# EAGLE design Brainzy (EAGLE 9.0.0)
CNAME: Mr. Robotics; CREVISION: 3.2.1; DESIGNER: O. LEVEQUE

## Sheet 1 of 2
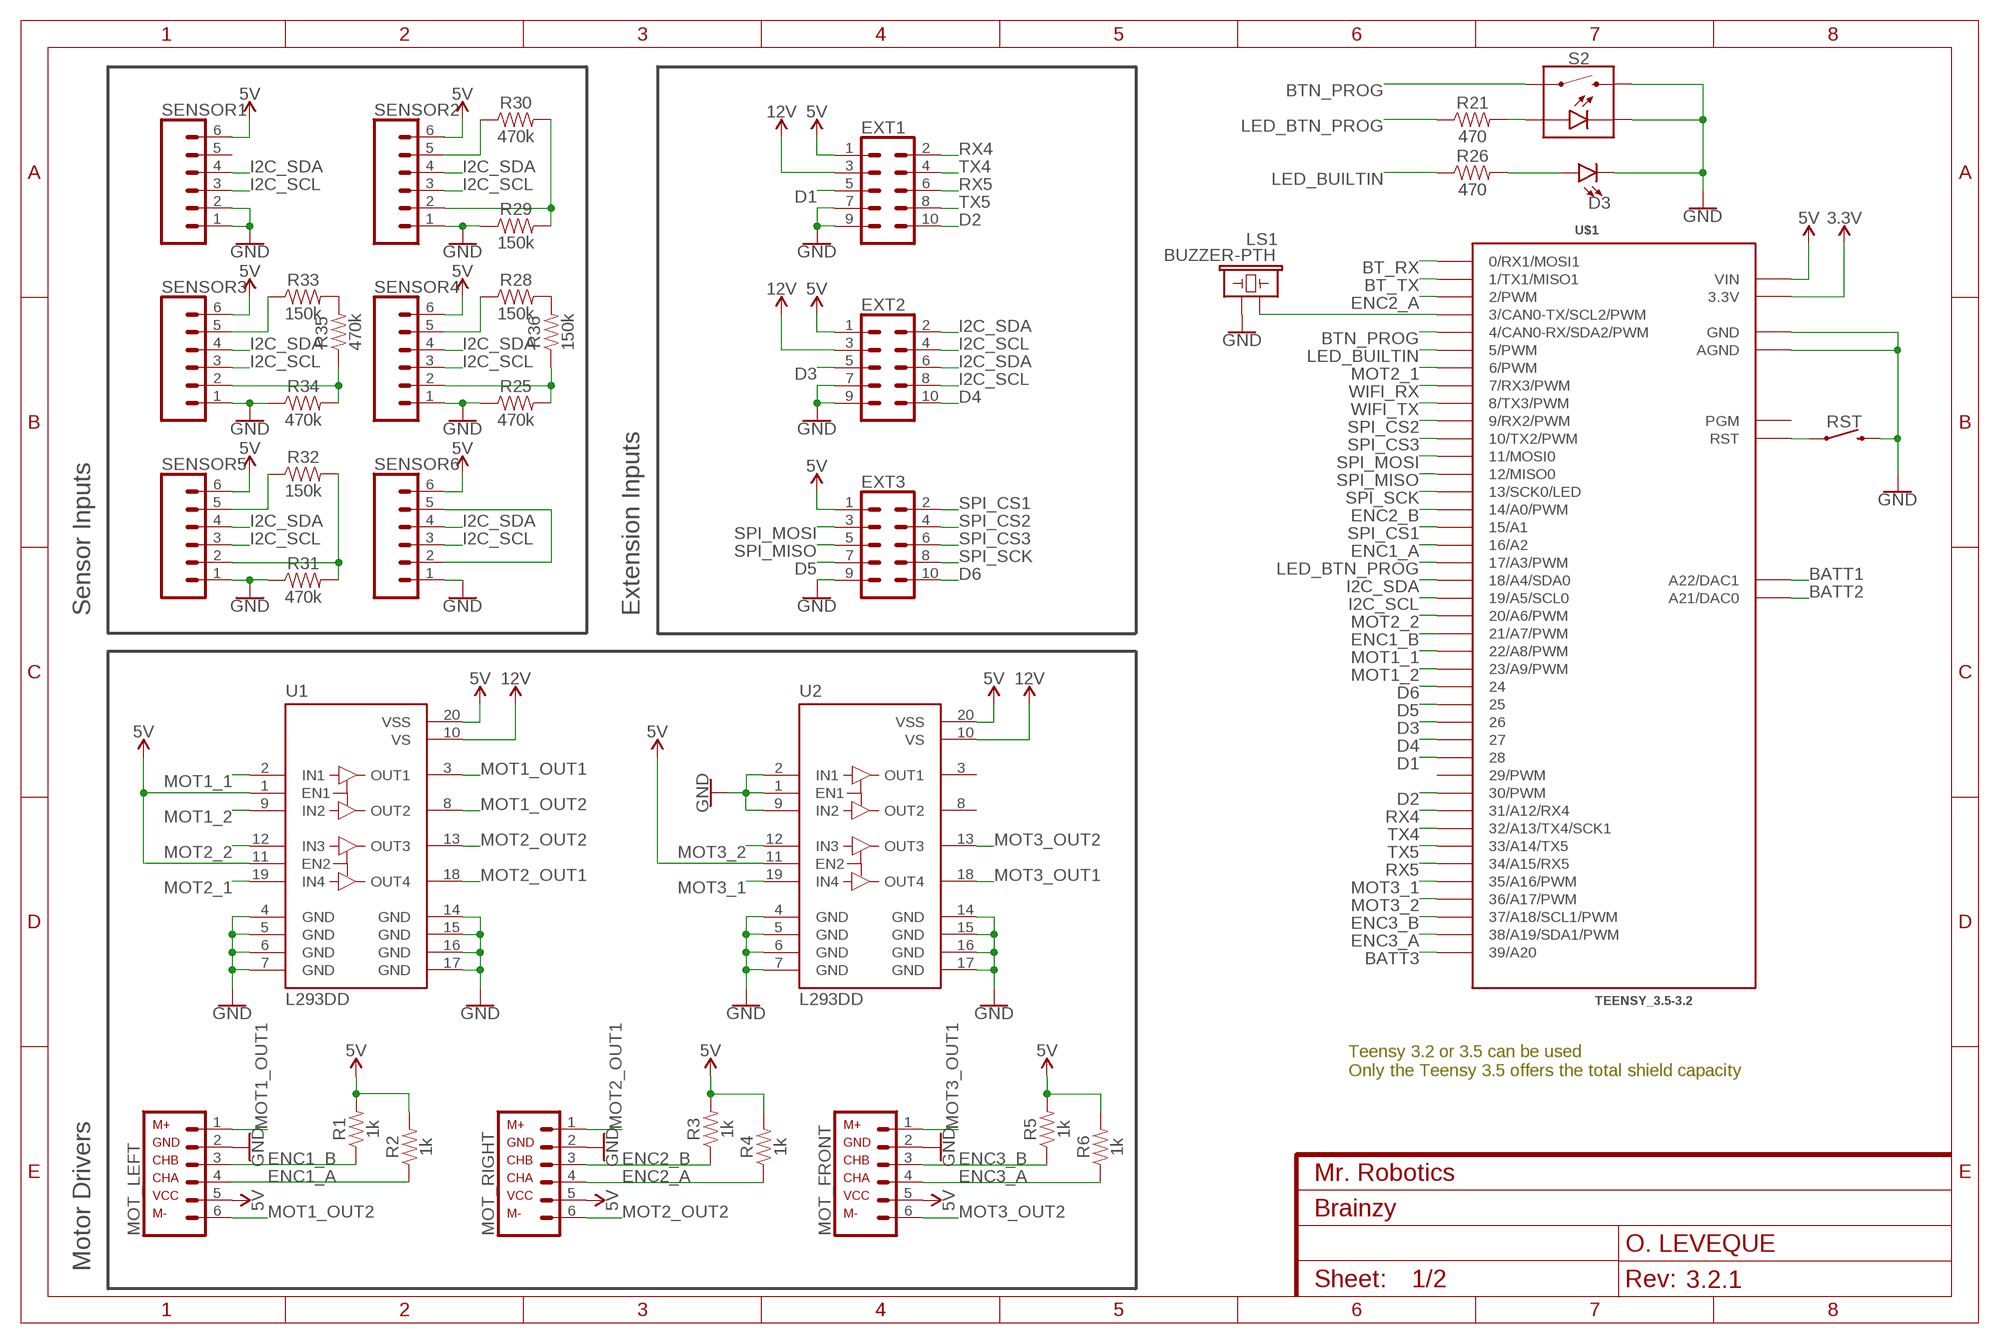
[diagram p0: schematic, sheet 1]

### Parts
D3  LED-FKIT-1206  [FKIT-LED-1206]
EXT1  CONN_05X2SHD_LOCK  [2X5-SHROUDED_LOCK]
EXT2  CONN_05X2SHD_LOCK  [2X5-SHROUDED_LOCK]
EXT3  CONN_05X2SHD_LOCK  [2X5-SHROUDED_LOCK]
LS1  BUZZER-PTH  [BUZZER-12MM]
MOT_FRONT  DC-MOTOR-CONNECTOR  [JST-PH6]
MOT_LEFT  DC-MOTOR-CONNECTOR  [JST-PH6]
MOT_RIGHT  DC-MOTOR-CONNECTOR  [JST-PH6]
R1  1k  10OHM-1206-1/4W-1%  [1206]
R2  1k  10OHM-1206-1/4W-1%  [1206]
R3  1k  10OHM-1206-1/4W-1%  [1206]
R4  1k  10OHM-1206-1/4W-1%  [1206]
R5  1k  10OHM-1206-1/4W-1%  [1206]
R6  1k  10OHM-1206-1/4W-1%  [1206]
R21  470  10OHM-1206-1/4W-1%  [1206]
R25  470k  10OHM-1206-1/4W-1%  [1206]
R26  470  10OHM-1206-1/4W-1%  [1206]
R28  150k  10OHM-1206-1/4W-1%  [1206]
R29  150k  10OHM-1206-1/4W-1%  [1206]
R30  470k  10OHM-1206-1/4W-1%  [1206]
R31  470k  10OHM-1206-1/4W-1%  [1206]
R32  150k  10OHM-1206-1/4W-1%  [1206]
R33  150k  10OHM-1206-1/4W-1%  [1206]
R34  470k  10OHM-1206-1/4W-1%  [1206]
R35  470k  10OHM-1206-1/4W-1%  [1206]
R36  150k  10OHM-1206-1/4W-1%  [1206]
RST  MOMENTARY-SWITCH-SPST-PTH-6.0MM  [TACTILE_SWITCH_PTH_6.0MM]
S2  MOMENTARY-SWITCH-SPST-LED-PTH-12MM  [TACTILE_SWITCH_LED_PTH_12MM]
SENSOR1  JST-ZH6  [JST-ZH6]
SENSOR2  JST-ZH6  [JST-ZH6]
SENSOR3  JST-ZH6  [JST-ZH6]
SENSOR4  JST-ZH6  [JST-ZH6]
SENSOR5  JST-ZH6  [JST-ZH6]
SENSOR6  JST-ZH6  [JST-ZH6]
U1  L293DD  [SOIC127P1033X265-20N]
U2  L293DD  [SOIC127P1033X265-20N]
U$1  TEENSY_3.5-3.2  [TEENSY_3.5-3.2]

### Nets
3.3V: U$1.3.3V U$1.3.3V1(3.3V) U$1.3.3V2(3.3V) U$1.3.3V3(3.3V) ; also sheet 2
5V: EXT1.1 EXT2.1 EXT3.1 MOT_FRONT.5(5-CHA) MOT_LEFT.5(5-CHA) MOT_RIGHT.5(5-CHA) R1.2 R2.2 R3.2 R4.2 R5.2 R6.2 SENSOR1.6 SENSOR2.6 SENSOR3.6 SENSOR4.6 SENSOR5.6 SENSOR6.6 U1.1(EN1) U1.11(EN2) U1.20(VSS) U2.11(EN2) U2.20(VSS) U$1.VIN ; also sheet 2
12V: EXT1.3 EXT2.3 U1.10(VS) U2.10(VS) ; also sheet 2
BATT1: U$1.A22(A22/DAC1) ; also sheet 2
BATT2: U$1.A21(A21/DAC0) ; also sheet 2
BATT3: U$1.39/A20 ; also sheet 2
BT_RX: U$1.0(0/RX1/MOSI1) ; also sheet 2
BT_TX: U$1.1(1/TX1/MISO1) ; also sheet 2
BTN_PROG: S2.4 U$1.4(4/CAN0-RX/SDA2/PWM)
BUZZER: LS1.+ U$1.3(3/CAN0-TX/SCL2/PWM)
D1: EXT1.5 U$1.28
D2: EXT1.10 U$1.30(30/PWM)
D3: EXT2.5 U$1.26
D4: EXT2.10 U$1.27
D5: EXT3.7 U$1.25
D6: EXT3.10 U$1.24
ENC1_A: MOT_LEFT.4(4-GND) R2.1 U$1.16/A2
ENC1_B: MOT_LEFT.3(3-VCC) R1.1 U$1.21/A7(21/A7/PWM)
ENC2_A: MOT_RIGHT.4(4-GND) R4.1 U$1.2(2/PWM)
ENC2_B: MOT_RIGHT.3(3-VCC) R3.1 U$1.14/A0(14/A0/PWM)
ENC3_A: MOT_FRONT.4(4-GND) R6.1 U$1.38/A19(38/A19/SDA1/PWM)
ENC3_B: MOT_FRONT.3(3-VCC) R5.1 U$1.37/A18(37/A18/SCL1/PWM)
GND: D3.C EXT1.7 EXT1.9 EXT2.7 EXT2.9 EXT3.9 LS1.- MOT_FRONT.2(2-M+) MOT_LEFT.2(2-M+) MOT_RIGHT.2(2-M+) R25.1 R29.1 R31.1 R34.1 RST.3 S2.2 S2.C SENSOR1.1 SENSOR1.2 SENSOR2.1 SENSOR3.1 SENSOR4.1 SENSOR5.1 SENSOR6.1 U1.4(GND) U1.5(GND) U1.6(GND) U1.7(GND) U1.14(GND) U1.15(GND) U1.16(GND) U1.17(GND) U2.1(EN1) U2.2(IN1) U2.4(GND) U2.5(GND) U2.6(GND) U2.7(GND) U2.9(IN2) U2.14(GND) U2.15(GND) U2.16(GND) U2.17(GND) U$1.AGND U$1.GND U$1.GND1(GND) U$1.GND2(GND) U$1.GND3(GND) ; also sheet 2
I2C_SCL: EXT2.4 EXT2.8 SENSOR1.3 SENSOR2.3 SENSOR3.3 SENSOR4.3 SENSOR5.3 SENSOR6.3 U$1.19/A5(19/A5/SCL0)
I2C_SDA: EXT2.2 EXT2.6 SENSOR1.4 SENSOR2.4 SENSOR3.4 SENSOR4.4 SENSOR5.4 SENSOR6.4 U$1.18/A4(18/A4/SDA0)
LED_BTN_PROG: R21.1 U$1.17/A3(17/A3/PWM)
LED_BUILTIN: R26.1 U$1.5(5/PWM)
MOT1_1: U1.2(IN1) U$1.22/A8(22/A8/PWM)
MOT1_2: U1.9(IN2) U$1.23/A9(23/A9/PWM)
MOT1_OUT1: MOT_LEFT.1(1-M-) U1.3(OUT1)
MOT1_OUT2: MOT_LEFT.6(6-CHB) U1.8(OUT2)
MOT2_1: U1.19(IN4) U$1.6(6/PWM)
MOT2_2: U1.12(IN3) U$1.20/A6(20/A6/PWM)
MOT2_OUT1: MOT_RIGHT.1(1-M-) U1.18(OUT4)
MOT2_OUT2: MOT_RIGHT.6(6-CHB) U1.13(OUT3)
MOT3_1: U2.19(IN4) U$1.35/A16(35/A16/PWM)
MOT3_2: U2.12(IN3) U$1.36/A17(36/A17/PWM)
MOT3_OUT1: MOT_FRONT.1(1-M-) U2.18(OUT4)
MOT3_OUT2: MOT_FRONT.6(6-CHB) U2.13(OUT3)
N$12: D3.A R26.2
N$16: R21.2 S2.A
N$17: SENSOR6.2 SENSOR6.5
N$20: R25.2 R36.1 SENSOR4.2
N$21: R28.1 SENSOR4.5
N$22: R31.2 R32.2 SENSOR5.2
N$23: R32.1 SENSOR5.5
N$24: R29.2 R30.2 SENSOR2.2
N$25: R30.1 SENSOR2.5
N$26: R33.2 R35.2
N$27: R34.2 R35.1 SENSOR3.2
N$28: R33.1 SENSOR3.5
N$29: R28.2 R36.2
RST: RST.1 U$1.RST_3.5(RST)
RX4: EXT1.2 U$1.31/A12(31/A12/RX4)
RX5: EXT1.6 U$1.34/A15(34/A15/RX5)
SPI_CS1: EXT3.2 U$1.15/A1
SPI_CS2: EXT3.4 U$1.9(9/RX2/PWM)
SPI_CS3: EXT3.6 U$1.10(10/TX2/PWM)
SPI_MISO: EXT3.5 U$1.12(12/MISO0)
SPI_MOSI: EXT3.3 U$1.11(11/MOSI0)
SPI_SCK: EXT3.8 U$1.13(13/SCK0/LED)
TX4: EXT1.4 U$1.32/A13(32/A13/TX4/SCK1)
TX5: EXT1.8 U$1.33/A14(33/A14/TX5)
WIFI_RX: U$1.7(7/RX3/PWM) ; also sheet 2
WIFI_TX: U$1.8(8/TX3/PWM) ; also sheet 2
Unconnected: SENSOR1.5 U2.3(OUT1) U2.8(OUT2) U$1.29(29/PWM) U$1.PGM_3.2(PGM) U$1.PGM_3.5(PGM)

### Notes on the sheet
- Sensor Inputs | Extension Inputs
- Teensy 3.2 or 3.5 can be used
  Only the Teensy 3.5 offers the total shield capacity
- Motor Drivers

## Sheet 2 of 2
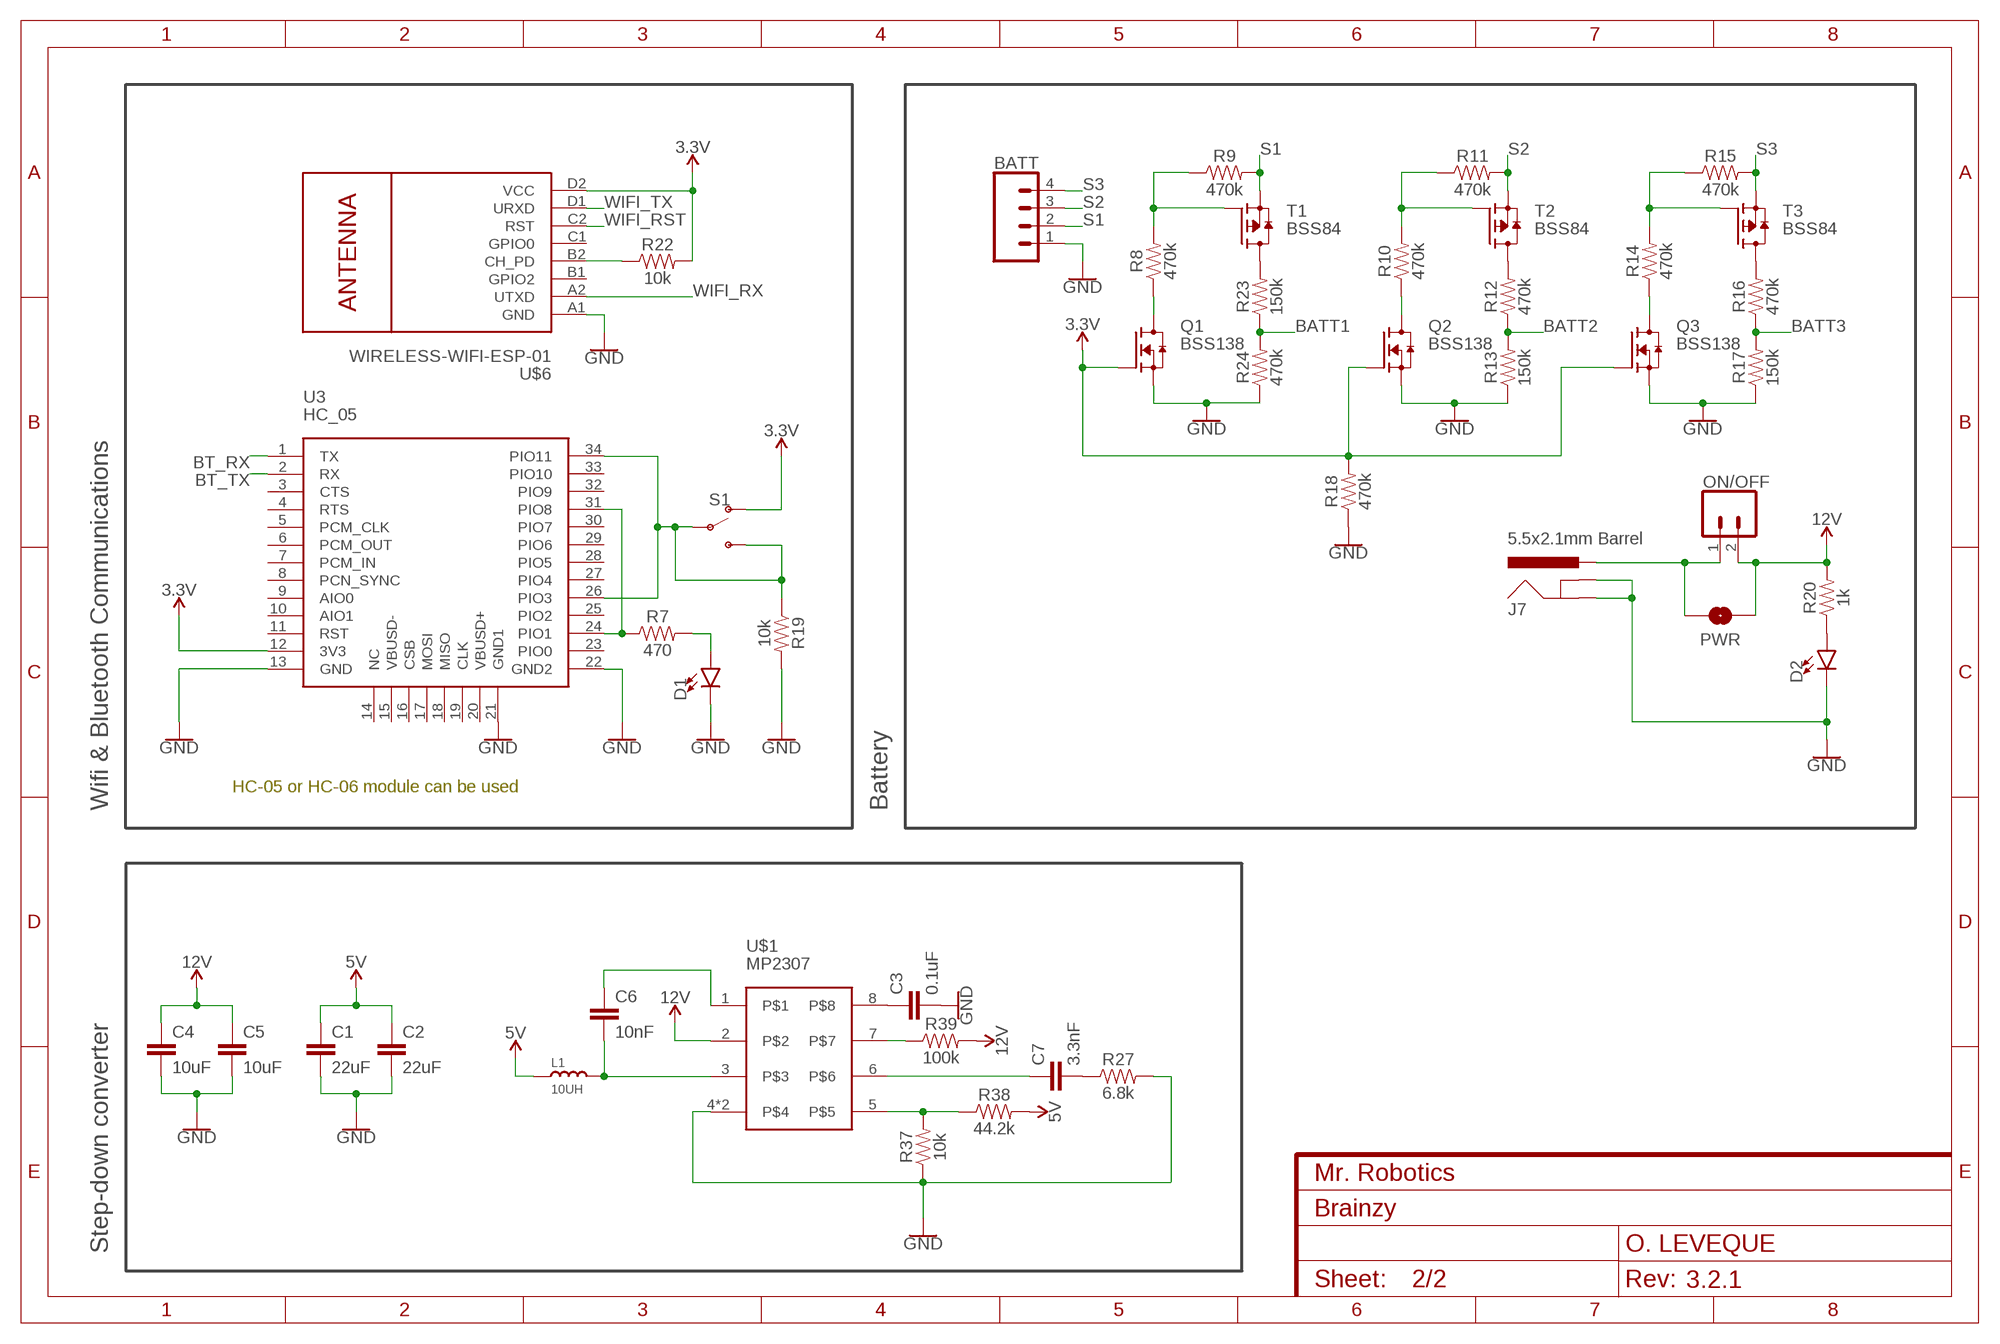
[diagram p1: schematic, sheet 2]

### Parts
BATT  CONN_04LOCK_LONGPADS  [1X04_LOCK_LONGPADS]
BK  MP2307  [SOIC127P600X170-9N]
C1  22uF  22UF-0805-6.3V-20%  [0805]
C2  22uF  22UF-0805-6.3V-20%  [0805]
C3  0.1uF  0.1UF-0603-25V-5%  [0603]
C4  10uF  10UF-1210-50V-20%  [1210]
C5  10uF  10UF-1210-50V-20%  [1210]
C6  10nF  10NF-0603-50V-10%  [0603]
C7  3.3nF  3.3NF-0603-100V-10%  [0603]
D1  LED-FKIT-1206  [FKIT-LED-1206]
D2  LED-FKIT-1206  [FKIT-LED-1206]
J7  5.5x2.1mm Barrel  POWER_JACKSMD  [POWER_JACK_SMD]
L1  10UH  SMD-INDUCTOR-10UH-20%(2P-6X6MM)'0630'  [SMD-2P-L6.0XW6.0XH3.0MM]
ON/OFF  JST-XH-02-PIN-LONG-PAD  [JST-XH-02-PACKAGE-LONG-PAD]
PWR  JUMPER-SMT_2_NO_SILK  [SMT-JUMPER_2_NO_SILK]
Q1  BSS138  [SOT23]
Q2  BSS138  [SOT23]
Q3  BSS138  [SOT23]
R7  470  10OHM-1206-1/4W-1%  [1206]
R8  470k  10OHM-1206-1/4W-1%  [1206]
R9  470k  10OHM-1206-1/4W-1%  [1206]
R10  470k  10OHM-1206-1/4W-1%  [1206]
R11  470k  10OHM-1206-1/4W-1%  [1206]
R12  470k  10OHM-1206-1/4W-1%  [1206]
R13  150k  10OHM-1206-1/4W-1%  [1206]
R14  470k  10OHM-1206-1/4W-1%  [1206]
R15  470k  10OHM-1206-1/4W-1%  [1206]
R16  470k  10OHM-1206-1/4W-1%  [1206]
R17  150k  10OHM-1206-1/4W-1%  [1206]
R18  470k  10OHM-1206-1/4W-1%  [1206]
R19  10k  10OHM-1206-1/4W-1%  [1206]
R20  1k  10OHM-1206-1/4W-1%  [1206]
R22  10k  10OHM-1206-1/4W-1%  [1206]
R23  150k  10OHM-1206-1/4W-1%  [1206]
R24  470k  10OHM-1206-1/4W-1%  [1206]
R27  6.8k  6.8KOHM-0603-1/10W-1%  [0603]
R37  10k  10KOHM-0603-1/10W-1%  [0603]
R38  44.2k  43KOHM-0603-1/10W-1%  [0603]
R39  100k  100KOHM-0603-1/10W-1%  [0603]
S1  SWITCH-SPDT-SMD-RIGHT-ANGLE  [SWITCH_SPST_SMD_A]
T1  BSS84  [SOT23]
T2  BSS84  [SOT23]
T3  BSS84  [SOT23]
U3  HC_05  [BLUETOOTH_SMD]
U$6  WIRELESS-WIFI-ESP-01  [WIRELESS-WIFI-ESP-01]

### Nets
3.3V: Q1.1(G) Q2.1(G) Q3.1(G) R18.2 R22.2 S1.1(O) U3.12(3V3) U$6.D2(VCC) ; also sheet 1
5V: C1.1 C2.1 L1.1 R38.2 ; also sheet 1
12V: BK.2 C4.1 C5.1 ON/OFF.2 PWR.2 R20.2 R39.2 ; also sheet 1
BATT1: R23.1 R24.2 ; also sheet 1
BATT2: R12.1 R13.2 ; also sheet 1
BATT3: R16.1 R17.2 ; also sheet 1
BT_RX: U3.1(TX) ; also sheet 1
BT_TX: U3.2(RX) ; also sheet 1
GND: BATT.1 BK.4 BK.9 C1.2 C2.2 C3.2 C4.2 C5.2 D1.C D2.C J7.GND(GNDBREAK) J7.P$4(GND) Q1.2(S) Q2.2(S) Q3.2(S) R13.1 R17.1 R18.1 R19.2 R24.1 R27.2 R37.1 U3.13(GND) U3.21(GND1) U3.22(GND2) U$6.A1(GND) ; also sheet 1
N$1: R12.2 T2.3(D)
N$2: D2.A R20.1
N$3: R22.1 U$6.B2(CH_PD)
N$4: R8.2 R9.1 T1.1(G)
N$5: Q1.3(D) R8.1
N$6: R16.2 T3.3(D)
N$7: R10.2 R11.1 T2.1(G)
N$8: BK.7 R39.1
N$9: R7.1 U3.24(PIO1) U3.31(PIO8)
N$10: D1.A R7.2
N$11: Q2.3(D) R10.1
N$13: R14.2 R15.1 T3.1(G)
N$14: Q3.3(D) R14.1
N$15: J7.VIN0(PWR) ON/OFF.1 PWR.1
N$18: R19.1 S1.2(P) S1.3(S) U3.26(PIO3) U3.34(PIO11)
N$19: R23.2 T1.3(D)
N$30: BK.5 R37.2 R38.1
N$32: BK.8 C3.1
N$33: BK.6 C7.1
N$34: BK.3 C6.2 L1.2
N$35: C7.2 R27.1
N$36: BK.1 C6.1
S1: BATT.2 R9.2 T1.2(S)
S2: BATT.3 R11.2 T2.2(S)
S3: BATT.4 R15.2 T3.2(S)
WIFI_RST: U$6.C2(RST)
WIFI_RX: U$6.A2(UTXD) ; also sheet 1
WIFI_TX: U$6.D1(URXD) ; also sheet 1
Unconnected: U3.3(CTS) U3.4(RTS) U3.5(PCM_CLK) U3.6(PCM_OUT) U3.7(PCM_IN) U3.8(PCN_SYNC) U3.9(AIO0) U3.10(AIO1) U3.11(RST) U3.14(NC) U3.15(VBUSD-) U3.16(CSB) U3.17(MOSI) U3.18(MISO) U3.19(CLK) U3.20(VBUSD+) U3.23(PIO0) U3.25(PIO2) U3.27(PIO4) U3.28(PIO5) U3.29(PIO6) U3.30(PIO7) U3.32(PIO9) U3.33(PIO10) U$6.B1(GPIO2) U$6.C1(GPIO0)

### Notes on the sheet
- HC-05 or HC-06 module can be used
- Wifi & Bluetooth Communications | Battery
- Step-down converter

## Library data of the parts
BATT = SparkFun-Connectors:CONN_04: Multi connection point. Often used as Generic Header-pin footprint for 0.1 inch spaced/style header connections On any of the 0.1 inch spaced packages, you can populate with these: Break Away Headers - Straight <https://www.sparkfun.com/products/116> (PRT-00116) Break Away Male Headers - Right Angle <https://www.sparkfun.com/products/553> (PRT-00553) Female Headers <https://www.sparkfun.com/products/115> (PRT-00115) Break Away Headers - Machine Pin <https://www.sparkfun.com/products/117> (PRT-00117) Break Away Female Headers - Swiss Machine Pin <https://www.sparkfun.com/products/743> (PRT-00743) For SCREWTERMINALS and SPRING TERMINALS visit here: Screw Terimnals on SparkFun.com <https://www.sparkfun.com/search/results?term=Screw+Terminals> (5mm/3.5mm/2.54mm spacing) This device is also useful as a general connection point to wire up your design to another part of your project. Our various solder wires solder well into these plated through hole pads. Hook-Up Wire - Assortment (Stranded, 22 AWG) <https://www.sparkfun.com/products/11375> (PRT-11375) Hook-Up Wire - Assortment (Solid Core, 22 AWG) <https://www.sparkfun.com/products/11367> (PRT-11367) View the entire wire category on our website here <https://www.sparkfun.com/categories/141> Special notes: Molex polarized connector foot print use with SKU : PRT-08231 with associated crimp pins and housings. 1MM SMD Version SKU: PRT-10208; PROD_ID: CONN-09696
BK = SOIC127P600X170-9N:MP2307
C1 C2 = SparkFun-Capacitors:22UF: 22µF ceramic capacitors A capacitor is a passive two-terminal electrical component used to store electrical energy temporarily in an electric field.; PROD_ID: CAP-08402
C3 = SparkFun-Capacitors:0.1UF: 0.1µF ceramic capacitors A capacitor is a passive two-terminal electrical component used to store electrical energy temporarily in an electric field.; PROD_ID: CAP-08604
C4 C5 = SparkFun-Capacitors:10UF: 10.0µF ceramic capacitors A capacitor is a passive two-terminal electrical component used to store electrical energy temporarily in an electric field.; PROD_ID: CAP-09824
C6 = SparkFun-Capacitors:10NF: 0.01uF/10nF/10,000pF ceramic capacitors A capacitor is a passive two-terminal electrical component used to store electrical energy temporarily in an electric field. CAP-09321; PROD_ID: CAP-00867
C7 = SparkFun-Capacitors:3.3NF: 3.3nF ceramic capacitors A capacitor is a passive two-terminal electrical component used to store electrical energy temporarily in an electric field.; PROD_ID: CAP-09633
D1-D3 = SparkFun-LED:LED: LED (Generic) Standard schematic elements and footprints for 5mm, 3mm, 1206, and 0603 sized LEDs. Generic LEDs with no color specified.
EXT1-EXT3 = SparkFun-Connectors:CONN_05X2: Multi connection point. Often used as Generic Header-pin footprint for 0.1 inch spaced/style header connections For AVR SPI programming port, see special device with nice symbol: "AVR_SPI_PROG_5x2.dev" You can populate with any combo of single row headers, but if you'd like an exact match, check these: 2x5 AVR ICSP Male Header <https://www.sparkfun.com/products/778> (PRT-00778) 2x5 Pin Shrouded Header <https://www.sparkfun.com/products/8506> (PRT-08506) On any of the 0.1 inch spaced packages, you can populate with these: Break Away Headers - Straight <https://www.sparkfun.com/products/116> (PRT-00116) Break Away Male Headers - Right Angle <https://www.sparkfun.com/products/553> (PRT-00553) Female Headers <https://www.sparkfun.com/products/115> (PRT-00115) Break Away Headers - Machine Pin <https://www.sparkfun.com/products/117> (PRT-00117) Break Away Female Headers - Swiss Machine Pin <https://www.sparkfun.com/products/743> (PRT-00743) Special note: the shrouded connector mates well with our 5x2 ribbon cables: 2x5 Pin IDC Ribbon Cable <https://www.sparkfun.com/products/8535> (PRT-08535); PROD_ID: CONN-08671; SF_ID: PRT-08506
J7 = SparkFun-Connectors:POWER_JACK: Power Jack Connector This is the standard 5.5mm barrel jack for power. The PTH is the most common, proven, reliable, footprint. The Slot footprint only works if the mill layer is transmitted to the PCB fab house so be warned. Here are the connectors we sell at SparkFun: DC Barrel Power Jack/Connector <https://www.sparkfun.com/products/119> (PRT-00119) DC Barrel Power Jack/Connector (SMD) <https://www.sparkfun.com/products/12748> (PRT-12748) DC Barrel Jack Adapter - Breadboard Compatible <https://www.sparkfun.com/products/10811> (PRT-10811) It is used on this SparkFun product (and many, many others): SparkFun RedBoard - Programmed with Arduino <https://www.sparkfun.com/products/12757> (DEV-12757) Also, if you need a mating power supply or connector, please check these out: Wall Adapter Power Supply - 9VDC 650mA <https://www.sparkfun.com/products/298> (TOL-00298) DC Barrel Jack Adapter - Male <https://www.sparkfun.com/products/10287> (PRT-10287); PROD_ID: CONN-08106; SF_ID: PRT-12748
L1 = Seeed-Inductor-2016:SMD-INDUCTOR-10UH-20%(2P-6X6MM): 303010016; MPN: CSAB0630-100M
LS1 = SparkFun-Electromechanical:BUZZER: Buzzer Small round buzzers that operate around the audible 2kHz range. You can use these as speakers to create simple music or user interfaces. Variant Overview: PTH - Mini Speaker - PC Mount 12mm 2.048kHz <https://www.sparkfun.com/products/7950> PTH_KIT - Mini Speaker - PC Mount 12mm 2.048kHz <https://www.sparkfun.com/products/7950> KIT simplifies soldering by adding stop mask to one side of the pads. PTH_NO_SILK - Mini Speaker - PC Mount 12mm 2.048kHz <https://www.sparkfun.com/products/7950> No silkscreen indicator of buzzer outline. PTH_KIT_NO_SILK - Mini Speaker - PC Mount 12mm 2.048kHz <https://www.sparkfun.com/products/7950> KIT package w/o silkscreen SMD - Buzzer Audio Magnetic (CCV-084B16) SMD buzzer used on, e.g. the LilyPad Buzzer <https://www.sparkfun.com/products/8463> and RFID USB Reader <https://www.sparkfun.com/products/9963>. SMD_KIT - Buzzer Audio Magnetic (CCV-084B16) SMD Buzzer with elongated pins to make soldering easier. Used on the SparkFun Simon Says - Surface Mount Soldering Kit <https://www.sparkfun.com/products/10935>.; PROD_ID: COMP-08253; SF_SKU: COM-07950
MOT_FRONT MOT_LEFT MOT_RIGHT = MrRobotics-Connectors:DC-MOTOR-CONNECTOR
ON/OFF = MrRobotics-Connectors:JST-XH-02-PIN: JST XH Connector 2 Pin Wire to board connector. Pitch: 2,54 mm, (0.100") Number of pins: 2 Created by Rembrandt Electronics www.rembrandtelectronics.com
PWR = SparkFun-Jumpers:JUMPER-SMT_2_NO: Normally open jumper This jumper has two pads in close proximity to each other. Apply solder to close the connection. Round pads are easier to solder for beginners, but are a lot larger. SparkFun Product that uses the round pads: SparkFun EL Sequencer <https://www.sparkfun.com/products/12781>
Q1-Q3 = MrRobotics-Transistors:BSS138: BSS138 N-Channel Logic Level Enhancement Mode Field Effect Transistor Source: http://www.fairchildsemi.com/datasheets/BS/BSS138.pdf
R1-R26 R28-R36 = SparkFun-Resistors:10OHM: 10Ω resistor A resistor is a passive two-terminal electrical component that implements electrical resistance as a circuit element. Resistors act to reduce current flow, and, at the same time, act to lower voltage levels within circuits. - Wikipedia; PROD_ID: RES-08705; VALUE: 10
R27 = SparkFun-Resistors:6.8KOHM: 6.8kΩ resistor A resistor is a passive two-terminal electrical component that implements electrical resistance as a circuit element. Resistors act to reduce current flow, and, at the same time, act to lower voltage levels within circuits. - Wikipedia; PROD_ID: RES-08597
R37 = SparkFun-Resistors:10KOHM: 10kΩ resistor A resistor is a passive two-terminal electrical component that implements electrical resistance as a circuit element. Resistors act to reduce current flow, and, at the same time, act to lower voltage levels within circuits. - Wikipedia; PROD_ID: RES-00824
R38 = SparkFun-Resistors:43KOHM: 43kΩ resistor A resistor is a passive two-terminal electrical component that implements electrical resistance as a circuit element. Resistors act to reduce current flow, and, at the same time, act to lower voltage levels within circuits. - Wikipedia; PROD_ID: RES-07858; VALUE: 43k
R39 = SparkFun-Resistors:100KOHM: 100kΩ resistor A resistor is a passive two-terminal electrical component that implements electrical resistance as a circuit element. Resistors act to reduce current flow, and, at the same time, act to lower voltage levels within circuits. - Wikipedia; PROD_ID: RES-07828
RST = SparkFun-Switches:MOMENTARY-SWITCH-SPST: Momentary Switch (Pushbutton) - SPST Normally-open (NO) SPST momentary switches (buttons, pushbuttons). Variants PTH-12MM - 12mm square, through-hole Momentary Pushbutton Switch - 12mm Square <https://www.sparkfun.com/products/9190> (COM-09190) PTH-6.0MM, PTH-6.0MM-KIT - 6.0mm square, through-hole Mini Pushbutton Switch <https://www.sparkfun.com/products/97> (COM-00097) KIT package intended for soldering kit's - only one side of pads' copper is exposed. PTH-RIGHT-ANGLE-KIT - Right-angle, through-hole Right Angle Tactile Button <https://www.sparkfun.com/products/10791> - Used on SparkFun BigTime Watch Kit <https://www.sparkfun.com/products/11734> SMD-12MM - 12mm square, surface-mount Tactile Button - SMD (12mm) <https://www.sparkfun.com/products/12993> (COM-12993) Used on SparkFun PicoBoard <https://www.sparkfun.com/products/11888> SMD-4.5MM - 4.5mm Square Trackball Switch Used on SparkFun Blackberry Trackballer Breakout <https://www.sparkfun.com/products/13169> SMD-4.6MMX2.8MM - 4.60mm x 2.80mm, surface mount Used on SparkFun SAMD21 Mini Breakout <https://www.sparkfun.com/products/13664> SMD-5.2MM, SMD-5.2-REDUNDANT - 5.2mm square, surface-mount Mini Pushbutton Switch - SMD <https://www.sparkfun.com/products/8720> (COM-08720) Used on Arduino Pro Mini <https://www.sparkfun.com/products/11114> REDUNDANT package connects both switch circuits together SMD-6.0X3.5MM - 6.0 x 3.5mm, surface mount Momentary Reset Switch SMD <https://www.sparkfun.com/products/8229> (COM-08229) SMD-6.2MM-TALL - 6.2mm square, surface mount Tactile Button - SMD (6mm) <https://www.sparkfun.com/products/12992> Used on SparkFun Digital Sandbox <https://www.sparkfun.com/products/12651> SMD-RIGHT-ANGLE - Right-angle, surface mount Used on SparkFun Block for Intel® Edison - Arduino <https://www.sparkfun.com/products/13036>; PROD_ID: SWCH-08441; SF_SKU: COM-00097
S1 = SparkFun-Switches:SWITCH-SPDT: Single Pole, Double Throw (SPDT) Switch Single-pole, double-throw (SPDT) switch. Variant Overview SMD-AYZ0202 Surface Mount DPDT Switch <https://www.sparkfun.com/products/597> (COM-00597) Used on e.g. LilyPad Arduino USB - ATmega32U4 Board <https://www.sparkfun.com/products/12049> PTH-11.6X4.0MM SPDT Mini Power Switch <https://www.sparkfun.com/products/102> (COM-00102) Used on e.g. SparkFun Simon Says - Through-Hole Soldering Kit <https://www.sparkfun.com/products/10547> (KIT-10547) PTH-11.6X4.0MM-KIT KIT version of SPDT Mini Power Switch - Simplifies soldering by removing tStop of switch pins - only one side can be soldered. PTH-11.6X4.0MM-LOCK LOCK version of SPDT Mini Power Switch - Offset pins hold switch in place for easier soldering. SMD-RIGHT-ANGLE Surface Mount Right Angle Switch <https://www.sparkfun.com/products/10860> (COM-10860) Used on e.g. SparkFun ESP8266 Thing <https://www.sparkfun.com/products/13231>; PROD_ID: SWCH-10651; SF_SKU: COM-10860
S2 = SparkFun-Switches:MOMENTARY-SWITCH-SPST-LED: Momentary Switch (Pushbutton) - SPST - w/ LED Normally-open (NO) SPST momentary switches (buttons, pushbuttons), with a built-in LED. Variants PTH-CHERRY - Cherry MX Switch Cherry MX Keyswitches are top-of-the-line mechanical keyboard switches. They’re satisfyingly “clicky”, reliable up to tens-of-millions of key presses, and a standard in gaming and programming keyboards across the globe. This ‘blue’ version Cherry MX Switch is favored by most due to its secondary internal actuator making it less likely to “double-tap.” If you are looking for a noticeably audible and high-quality key switch, this is the perfect option for you! Cherry MX Switch <https://www.sparkfun.com/products/13834> (COM-13834) Cherry MX Switch Breakout <https://www.sparkfun.com/products/13773> (BOB-13773) PTH-12MM and PTH-12MM-KIT - 12mm Illuminated LED KIT variant is for soldering kits. There is no tStop (covering up the top side of the pads with mask). This helps the beginner see which side they should be soldering too. LED Tactile Button Breakout <https://www.sparkfun.com/products/10467> (BOB-10467) LED Tactile Button - Red <https://www.sparkfun.com/products/10442> (COM-10442) LED Tactile Button - Blue <https://www.sparkfun.com/products/10443> (COM-10443) LED Tactile Button - Green <https://www.sparkfun.com/products/10440> (COM-10440) LED Tactile Button - Orange <https://www.sparkfun.com/products/10441> (COM-10441) LED Tactile Button - White <https://www.sparkfun.com/products/10439> (COM-10439); PROD_ID: SWCH-11758; SF_SKU: COM-10442
SENSOR1-SENSOR6 = MrRobotics-Connectors:JST-ZH6
T1-T3 = MrRobotics-Transistors:BSS84: P-channel enhancement mode vertical DMOS transistor P-channel enhancement mode vertical Diffusion Metal-Oxide Semiconductor (DMOS) transistor in a small Surface-Mounted Device (SMD) plastic package.
U1 U2 = MrRobotics-Components:L293DD: L293DD Series Push - Pull Quad Channel Driver with Diodes - SOIC-20; AVAILABILITY: Good; DESCRIPTION: L293DD Series Push - Pull Quad Channel Driver with Diodes - SOIC-20; MF: STMicroelectronics; MP: L293DD; PACKAGE: SOIC-20 STMicroelectronics; PRICE: 2.68 USD
U3 = MrRobotics-Components:HC_05
U$1 = MrRobotics-Boards:TEENSY_3.5-3.2
U$6 = MrRobotics-Modules:WIRELESS-WIFI-ESP-01: Wireless Wi-Fi ESP-01 Module based on ESP8266 chip Click here to find device on ebay.com <http://www.ebay.com/sch/esp8266+esp+01+transceiver>

## Board
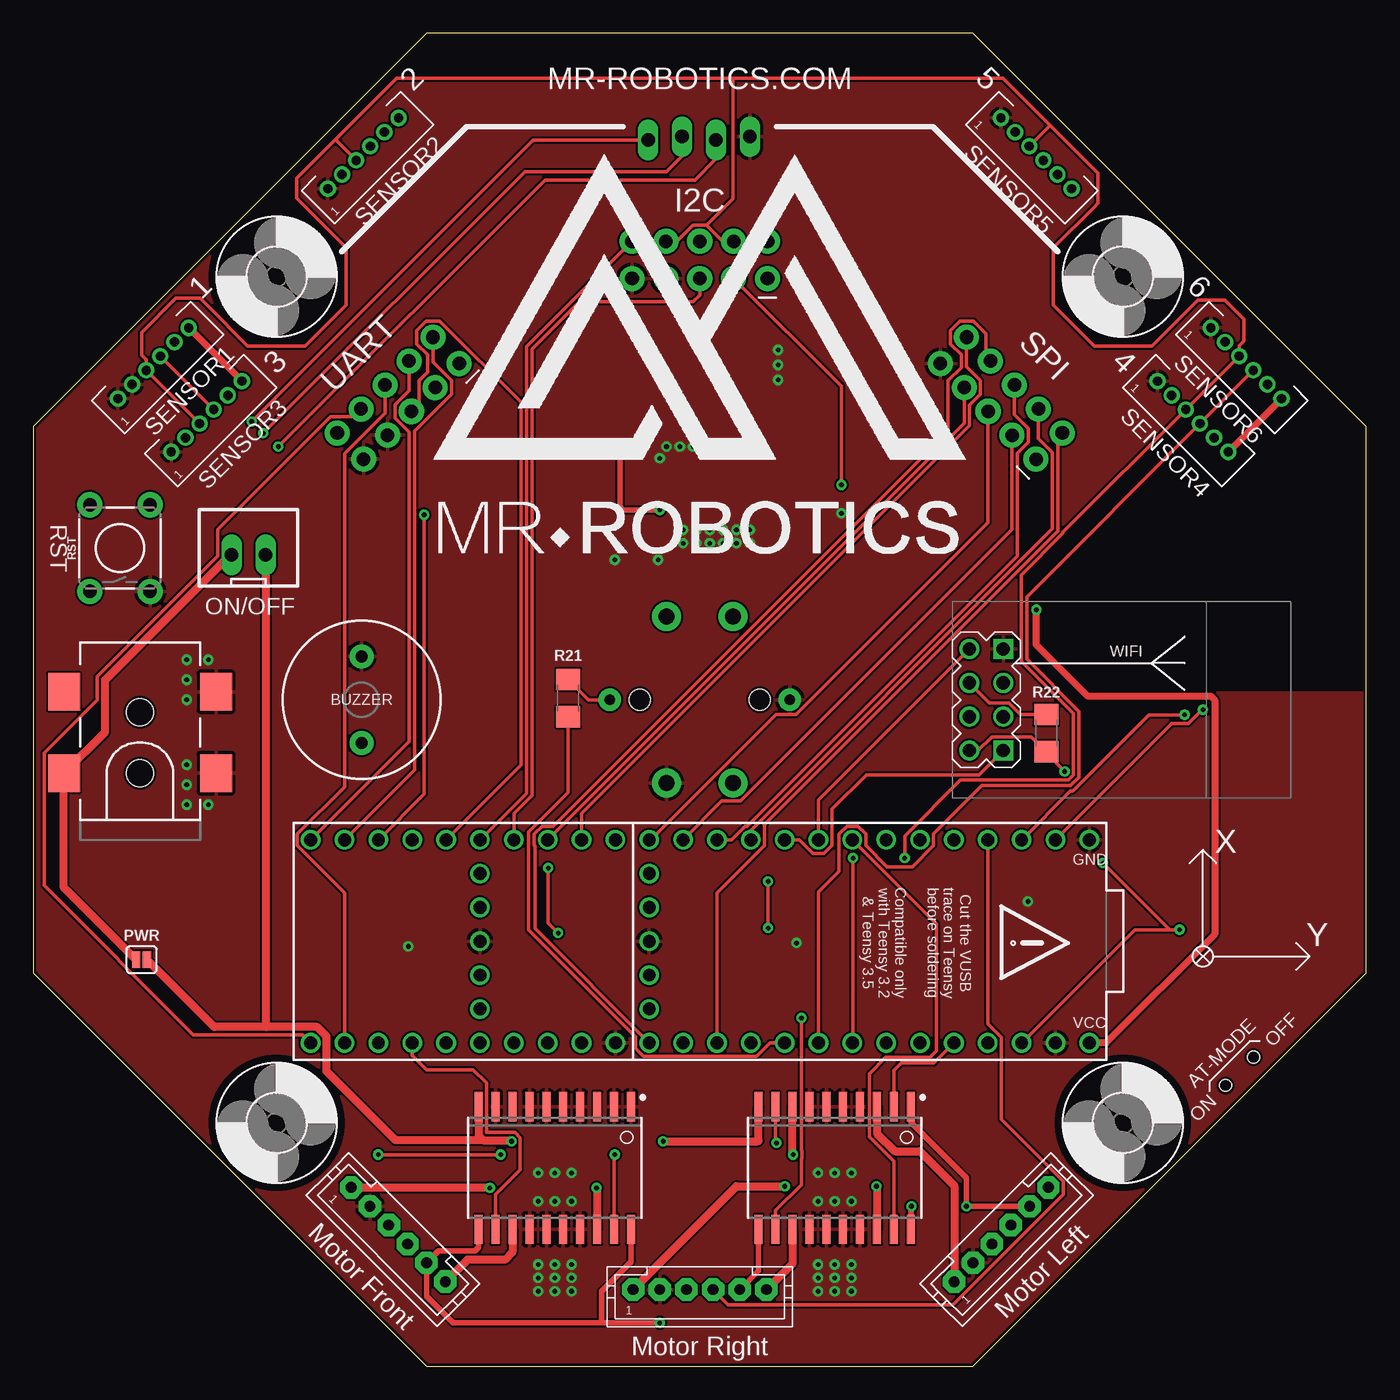
[diagram p2: board, top side]
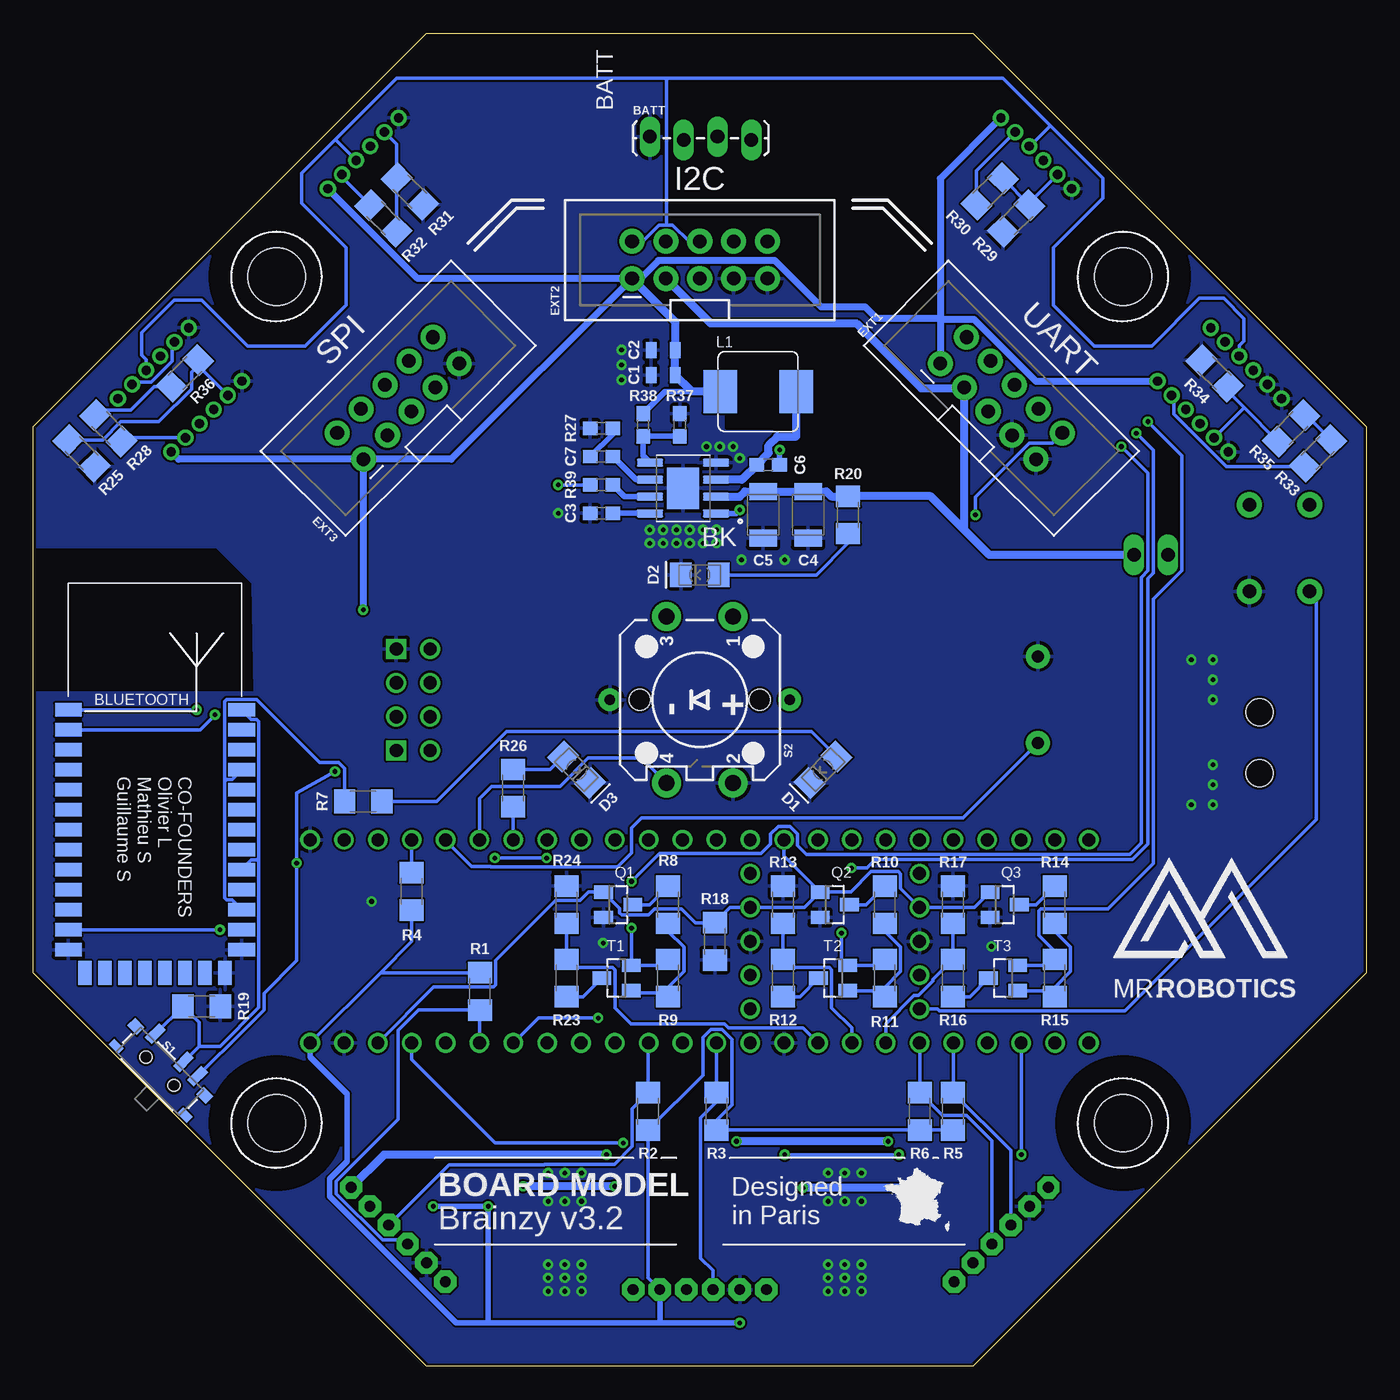
[diagram p3: board, bottom side, seen from below]

Size 100 x 100 mm. Coordinates in mm from the lower left corner, seen from the top.
Outline: 0,70.5 0,29.5 29.5,0 70.5,0 100,29.5 100,70.5 70.5,100 29.5,100 0,70.5
Copper layers (1*16): Top 0.035mm / dielectric 1.5mm / Bottom 0.035mm
Design rules "default *": minimum track width 6mil, minimum drill 12mil, track to track 6mil, track to pad 6mil, pad to pad 6mil, via to via 6mil, smd to smd 6mil, copper to edge 8mil, drill to drill 6mil, minimum pad ring 10mil, minimum via ring 8mil, stop-mask expansion 4mil, vias tented up to drill 0mil, thermal gap 10mil
bRestrict: 12 lines

### Footprints (pad centres in the part's own frame; a part is rotated, then mirrored left to right if it is on the bottom)
1X04_LOCK_LONGPADS = drill 1.016 long: 1 0,0; 2 2.54,-0.254; 3 5.08,0; 4 7.62,-0.254
SOIC127P600X170-9N = smd 1.97 x 0.6: 1 -2.475,1.905; 2 -2.475,0.635; 3 -2.475,-0.635; 4 -2.475,-1.905; 5 2.475,-1.905; 6 2.475,-0.635; 7 2.475,0.635; 8 2.475,1.905 | smd 2.4 x 3.1: 9 0,0
0805 = smd 0.8 x 1.2: 1 -0.9,0; 2 0.9,0
0603 = smd 1.1 x 1: 1 -0.85,0; 2 0.85,0
1210 = smd 1.27 x 2.06: 1 -1.755,0; 2 1.755,0
FKIT-LED-1206 = smd 1.6 x 1.803: A -1.422,0; C 1.422,0
2X5-SHROUDED_LOCK = drill 1.016 pad 1.88: 1 -1.397,5.08; 2 1.397,5.08; 3 -1.397,2.54; 4 1.397,2.54; 5 -1.397,0; 6 1.397,0; 7 -1.397,-2.54; 8 1.397,-2.54; 9 -1.397,-5.08; 10 1.397,-5.08
POWER_JACK_SMD = smd 2.8 x 2.4: GND 0,-5.7; P$4 6.1,-5.7; VIN0 0,5.7; VIN1 6.1,5.7 | hole 2.032: 0,0; 4.572,0
SMD-2P-L6.0XW6.0XH3.0MM = smd 2.5 x 3.2: 1 -2.85,0; 2 2.85,0
BUZZER-12MM = drill 0.9 pad 1.778: + 3.25,0; - -3.25,0
JST-PH6 = drill 0.813 pad 1.676 octagon: 1 5,0; 2 3,0; 3 1,0; 4 -1,0; 5 -3,0; 6 -5,0
JST-XH-02-PACKAGE-LONG-PAD = drill 1.016 long: 1 0,0; 2 2.54,0
SMT-JUMPER_2_NO_SILK = smd 0.635 x 1.27: 1 -0.406,0; 2 0.406,0
SOT23 = smd 1 x 1.4: 1 -0.95,-1.1; 2 0.95,-1.1; 3 0,1.1
1206 = smd 1.6 x 1.8: 1 -1.4,0; 2 1.4,0
TACTILE_SWITCH_PTH_6.0MM = drill 1.016 pad 1.88: 1 -3.251,2.261; 2 3.251,2.261; 3 -3.251,-2.261; 4 3.251,-2.261
SWITCH_SPST_SMD_A = smd 0.7 x 1.5: 1 -2.25,-1.75; 2 -0.75,-1.75; 3 2.25,-1.75 | smd 1 x 0.6: GND1 -3.65,1; GND3 3.65,1 | smd 1 x 0.8: GND2 -3.65,-1.1; GND4 3.65,-1.1 | hole 0.9: -1.5,0; 1.5,0
TACTILE_SWITCH_LED_PTH_12MM = drill 1.2 pad 2.159: 1 -6.25,2.5; 2 6.25,2.5; 3 -6.25,-2.5; 4 6.25,-2.5 | drill 0.8 pad 1.676: A 0,6.75; C 0,-6.75 | hole 1.6: 0,4.5; 0,-4.5
JST-ZH6 = drill 0.7: 1 3.75,0; 2 2.25,0; 3 0.75,0; 4 -0.75,0; 5 -2.25,0; 6 -3.75,0
SOIC127P1033X265-20N = smd 2.2 x 0.6: 1 -4.6,5.715; 2 -4.6,4.445; 3 -4.6,3.175; 4 -4.6,1.905; 5 -4.6,0.635; 6 -4.6,-0.635; 7 -4.6,-1.905; 8 -4.6,-3.175; 9 -4.6,-4.445; 10 -4.6,-5.715; 11 4.6,-5.715; 12 4.6,-4.445; 13 4.6,-3.175; 14 4.6,-1.905; 15 4.6,-0.635; 16 4.6,0.635; 17 4.6,1.905; 18 4.6,3.175; 19 4.6,4.445; 20 4.6,5.715
BLUETOOTH_SMD = smd 2 x 1: 1 0,0; 2 0,-1.5; 3 0,-3; 4 0,-4.5; 5 0,-6; 6 0,-7.5; 7 0,-9; 8 0,-10.5; 9 0,-12; 10 0,-13.5; 11 0,-15; 12 0,-16.5; 13 0,-18; 22 13,-18; 23 13,-16.5; 24 13,-15; 25 13,-13.5; 26 13,-12; 27 13,-10.5; 28 13,-9; 29 13,-7.5; 30 13,-6; 31 13,-4.5; 32 13,-3; 33 13,-1.5; 34 13,0 | smd 1 x 1.8: 14 1.25,-19.75; 15 2.75,-19.75; 16 4.25,-19.75; 17 5.75,-19.75; 18 7.25,-19.75; 19 8.75,-19.75; 20 10.25,-19.75; 21 11.75,-19.75
TEENSY_3.5-3.2 = drill 0.965: 0 -7.62,27.94; 1 -7.62,25.4; 2 -7.62,22.86; 3 -7.62,20.32; 3.3V 7.62,25.4; 3.3V1 -7.62,-5.08; 3.3V2 -2.54,-15.24; 3.3V3 -2.54,-2.54; 4 -7.62,17.78; 5 -7.62,15.24; 6 -7.62,12.7; 7 -7.62,10.16; 8 -7.62,7.62; 9 -7.62,5.08; 10 -7.62,2.54; 11 -7.62,0; 12 -7.62,-2.54; 13 7.62,-2.54; 14/A0 7.62,0; 15/A1 7.62,2.54; 16/A2 7.62,5.08; 17/A3 7.62,7.62; 18/A4 7.62,10.16; 19/A5 7.62,12.7; 20/A6 7.62,15.24; 21/A7 7.62,17.78; 22/A8 7.62,20.32; 23/A9 7.62,22.86; 24 -7.62,-7.62; 25 -7.62,-10.16; 26 -7.62,-12.7; 27 -7.62,-15.24; 28 -7.62,-17.78; 29 -7.62,-20.32; 30 -7.62,-22.86; 31/A12 -7.62,-25.4; 32/A13 -7.62,-27.94; 33/A14 7.62,-27.94; 34/A15 7.62,-25.4; 35/A16 7.62,-22.86; 36/A17 7.62,-20.32; 37/A18 7.62,-17.78; 38/A19 7.62,-15.24; 39/A20 7.62,-12.7; A14/DAC 5.08,-2.54; A21 7.62,-10.16; A22 7.62,-7.62; AGND 7.62,27.94; GND -7.62,30.48; GND1 7.62,-5.08; GND2 0,-15.24; GND3 0,-2.54; PGM_3.2 2.54,-2.54; PGM_3.5 2.54,-15.24; RST_3.5 5.08,-15.24; VBAT_3.2 -5.08,-2.54; VBAT_3.5 -5.08,-15.24; VIN 7.62,30.48
WIRELESS-WIFI-ESP-01 = drill 1 square: A1 1.27,3.81; D1 1.27,-3.81 | drill 1: A2 -1.27,3.81; B1 1.27,1.27; B2 -1.27,1.27; C1 1.27,-1.27; C2 -1.27,-1.27; D2 -1.27,-3.81
4,3 = hole 4.3: 0,0

### Placement (x,y rotation side)
BATT  53.75,92.25 0 bottom
BK  51.25,65.88 180 bottom
C1  52.75,74.38 180 bottom
C2  52.75,76.25 180 bottom
C3  57.38,64 180 bottom
C4  41.88,63.88 270 bottom
C5  45.25,63.88 270 bottom
C6  44.88,67.62 180 bottom
C7  57.38,68.25 180 bottom
D1  40.75,44.75 225 bottom
D2  50,59.38 180 bottom
D3  59.25,44.75 315 bottom
EXT1  27.38,72.62 45 bottom
EXT2  50,83 90 bottom
EXT3  72.62,72.62 135 bottom
J7  8,44.5 90 top
L1  45.62,73.12 0 bottom
LS1  24.62,50 270 top
MOT_FRONT  27.38,9.88 135 top
MOT_LEFT  72.62,9.88 225 top
MOT_RIGHT  50,5.75 180 top
ON/OFF  14.88,60.88 0 top
PWR  8.12,30.5 0 top
Q1  56.12,34.62 270 bottom
Q2  39.88,34.62 270 bottom
Q3  27.12,34.62 270 bottom
R1  66.5,28.12 90 bottom
R2  53.88,19.12 270 bottom
R3  48.75,19.12 270 bottom
R4  71.62,35.62 270 bottom
R5  31,19.12 270 bottom
R6  33.5,19.12 270 bottom
R7  75.25,42.38 0 bottom
R8  52.38,34.62 270 bottom
R9  52.38,29.12 90 bottom
R10  36.12,34.62 270 bottom
R11  36.12,29.12 90 bottom
R12  43.75,29.12 270 bottom
R13  43.75,34.62 270 bottom
R14  23.38,34.62 270 bottom
R15  23.38,29.12 90 bottom
R16  31,29.12 270 bottom
R17  31,34.62 270 bottom
R18  48.88,31.88 90 bottom
R19  87.38,27 0 bottom
R20  38.88,63.88 90 bottom
R21  40.12,50.12 90 top
R22  76,47.5 270 top
R23  60,29.12 270 bottom
R24  60,34.62 270 bottom
R25  96.38,68.5 135 bottom
R26  64,43.38 90 bottom
R27  57.38,70.38 180 bottom
R28  94.38,70.38 135 bottom
R29  26.25,86.12 45 bottom
R30  28.25,88.12 45 bottom
R31  71.75,88.12 135 bottom
R32  73.75,86.12 315 bottom
R33  3.62,68.5 45 bottom
R34  11.38,74.5 315 bottom
R35  5.62,70.38 45 bottom
R36  88.62,74.5 225 bottom
R37  51.5,70.62 270 bottom
R38  54.25,70.62 90 bottom
R39  57.38,66.12 180 bottom
RST  6.5,61.38 90 top
S1  90.5,22.12 135 bottom
S2  50,50 270 bottom
SENSOR1  9,75.25 225 top
SENSOR2  24.75,91 225 top
SENSOR3  13,71.25 225 top
SENSOR4  87,71.25 135 top
SENSOR5  75.25,91 135 top
SENSOR6  91,75.25 135 top
T1  56.25,29.12 90 bottom
T2  40,29.12 90 bottom
T3  27.25,29.12 90 bottom
U1  60.12,14.88 270 top
U2  39.12,14.88 270 top
U3  97.38,49.25 0 bottom
U$1  48.75,31.88 270 top
U$3  [LOGO_FR]  36.25,10.12 0 bottom
U$4  [M_40MM]  30,68 0 top
U$6  71.5,50 0 top
U$8  [4,3]  18.25,18.25 0 top
U$9  [4,3]  81.75,18.25 0 top
U$10  [4,3]  81.75,81.75 0 top
U$11  [4,3]  18.25,81.75 0 top
U$12  [LOGO_M]  19,30.62 0 bottom
U$13  [NAME_40MM]  30.38,61 0 top

### Tracks (layer width: path | path; a pad name or v marks a point on that pad's centre or on a via)
3.3V  (via drill 0.35)
  Top 0.254: U$6.D2 70.87,46.19 71.9,47.22 74.88,47.22 R22.2 76,46 v77.38,44.62 | v80.25,37.75 85.25,32.75 v86,32.75 82.65,32.75 U$1.3.3V
  Bottom 0.254: Q3.1 29.39,34.41 U$1.3.3V2 34.95,35.85 34.95,36.94 35.11,37.1 37.14,37.1 38.67,35.58 Q2.1 | Q2.1 43.67,38.27 U$1.3.3V1 | Q2.1 42.13,34.41 U$1.3.3V3 47.73,34.41 R18.2 50.33,33.27 51.36,34.3 53.39,34.3 53.85,33.85 55.84,33.85 56,34.01 56,34.35 Q1.1 58.36,35.58 58.98,34.95 60.82,34.95 65.32,30.44 65.32,28.61 65.48,28.45 69.96,28.45 U$1.3.3V | v86,32.75 U3.12 | v77.38,44.62 80.25,43 v80.25,37.75 80.25,30.43 82.69,27.99 82.69,26.74 85.83,23.59 85.85,23.59 85.97,23.47 S1.1
5V  (via drill 0.35)
  Top 0.254: U1.11 54.41,9.59 | 45.88,3.29 45.88,3.25
  Top 0.406: v47,3.25 45.88,3.25 42.62,3.25 | 42.62,3.25 31.5,3.25 29.5,5.25 MOT_FRONT.5 30.4,8.66 33.16,8.66 33.41,8.91 U2.11 | U1.11 54.41,7.16 MOT_RIGHT.5 | U2.20 44.84,7.84 42.62,5.62 42.62,3.25 | U1.20 65.84,11.97 v65.88,12 | U1.1 65.84,18.29 70,14.12 v70,12 MOT_LEFT.5
  Top 0.508: v75.25,56.75 75.25,54.12 79.12,50.25 88.38,50.25 88.62,50 88.62,32.4 80.48,24.25 U$1.VIN | SENSOR6.6 SENSOR4.6 | SENSOR1.6 SENSOR3.6
  Bottom 0.254: 73.96,29.52 U$1.VIN | R1.2 73.96,29.52 | R4.2 71.62,31.86 73.96,29.52 | R5.2 R6.2 R3.2 48.75,18.43 47.57,19.61 47.57,24.51 48.33,25.27 49.17,25.27 49.77,24.68 49.77,21.83 R2.2 53.88,6.62 MOT_RIGHT.5
  Bottom 0.406: U$1.VIN 79.23,23.2 76.47,20.44 76.47,15.37 77.76,14.07 77.76,12.75 68.26,3.25 65.75,3.25 | 65.75,3.25 53,3.25 | 53,3.25 v47,3.25 | MOT_RIGHT.5 53,3.25 | 65.75,3.25 65.88,3.38 v65.88,12 v70,12 | R38.2 52.6,73.12 50.6,73.12
  Bottom 0.508: v75.25,56.75 75.23,56.77 EXT3.1 | EXT2.1 54.44,81.6 53.1,82.95 44.36,82.95 40.89,79.48 37.61,79.48 36.75,78.62 31.95,78.62 | EXT2.1 68.64,68.05 EXT3.1 | EXT2.1 71.16,81.6 SENSOR5.6 | SENSOR2.6 31.95,89.1 31.95,78.62 | 31.95,78.62 EXT1.1 | SENSOR3.6 24.77,73.9 29.42,78.55 31.88,78.55 31.95,78.62 | EXT3.1 89.1,68.05 SENSOR4.6
  Bottom 0.61: L1.1 50.6,73.12 C1.1 C2.1 51.85,78.37 EXT2.1
12V  (via drill 0.35)
  Top 0.254: EXT2.3 60.62,73.52 v60.62,66.12
  Top 0.61: v47.25,16.88 54.38,16.88 54.41,16.91 U1.10 | 33.75,16.95 33.41,17.29 U2.10 | v35.88,16.88 35.8,16.95 33.75,16.95 | 33.75,16.95 27.18,16.95 22,22.12 22,24.75 21.3,25.45 17.5,25.45 | PWR.2 13.58,25.45 17.5,25.45 | ON/OFF.2 17.41,25.53 17.5,25.45
  Bottom 0.254: v60.62,66.12 R39.2
  Bottom 0.61: 30.16,62.75 30.16,73.38 | 30.16,73.38 EXT1.3 | ON/OFF.2 28.28,60.88 30.16,62.75 | v35.88,16.88 v47.25,16.88 | 30.16,62.75 32.68,65.28 R20.2 38.9,65.25 40.12,65.25 40.51,65.63 C4.1 C5.1 46.62,65.63 47.01,65.24 BK.2 | EXT2.3 49.19,78.25 38.25,78.25 33.38,73.38 30.16,73.38
BATT1
  Bottom 0.254: R24.2 R23.1 59.38,29.9 56.53,29.9 56.37,29.74 56.37,26.9 55.15,25.68 48.16,25.68 47.86,25.38 42.25,25.38 U$1.A22
BATT2
  Bottom 0.254: R13.2 R12.1 43.13,29.9 40.28,29.9 40.12,29.74 40.12,26.9 38.59,25.36 U$1.A21
BATT3
  Bottom 0.254: R17.2 R16.1 32.49,29.03 32.49,28.91 33.6,27.81 33.93,27.81 36.05,25.69 U$1.39/A20
BT_RX  (via drill 0.35)
  Top 0.254: v87.75,49.25 87.68,49.25 86.65,48.22 85.41,48.22 U$1.0
  Bottom 0.254: v87.75,49.25 U3.1
BT_TX  (via drill 0.35)
  Top 0.254: U$1.1 77.81,43.16 77.98,43.16 83.7,48.88 v86.38,48.88
  Bottom 0.254: U3.2 87.5,47.75 v86.38,48.88
BTN_PROG
  Bottom 0.254: S2.4 54.38,45.62 58.38,45.62 60.5,43.5 62.5,43.5 65.62,43.5 66.53,42.59 U$1.4
BUZZER
  Bottom 0.254: U$1.3 69.07,39.45 67.12,37.5 65.68,37.5 65.65,37.47 56.16,37.47 55.12,38.5 55.12,40.38 54.38,41.12 30.25,41.12 LS1.+
D1
  Top 0.254: EXT1.5 28.94,72.21 28.94,73.94 29.57,74.57 29.57,75.89 28.76,76.7 28.76,77.71 29.47,78.42 30.48,78.42 36.59,72.31 36.59,45.12 U$1.28
D2  (via drill 0.35)
  Top 0.254: U$1.30 29.32,42.93 v29.32,63.88
  Bottom 0.254: EXT1.10 23.55,69.26 25.28,69.26 29.32,65.22 v29.32,63.88
D3
  Top 0.254: EXT2.5 50,80.38 49.5,79.88 40.97,79.88 37.41,76.31 37.41,42.82 36.05,41.46 U$1.26
D4
  Top 0.254: EXT2.10 37,76.48 37,42.98 U$1.27
D5
  Top 0.254: U$1.25 69.84,70.75 EXT3.7
D6
  Top 0.254: EXT3.10 70.02,74.98 71.06,73.94 71.06,72.93 70.25,72.11 70.25,70.58 41.13,41.46 U$1.24
ENC1_A
  Bottom 0.254: U$1.16/A2 53.88,24.21 R2.1 55.09,19.31 55.09,16.48 56.41,15.16 61.65,15.16 61.68,15.12 68.79,15.12 MOT_LEFT.4
ENC1_B
  Bottom 0.254: U$1.21/A7 66.53,26.7 R1.1 71.1,26.73 72.63,25.2 72.63,18.53 77.28,13.87 77.28,12.95 73.8,9.46 72.21,9.46 MOT_LEFT.3
ENC2_A
  Top 0.254: U$1.2 71.61,25.69 72.63,24.68 72.63,18.53 77.28,13.87 77.28,12.9 69,4.62 52.12,4.62 MOT_RIGHT.4
  Bottom 0.254: U$1.2 71.62,39.48 R4.1
ENC2_B
  Bottom 0.254: U$1.14/A0 R3.1 48.75,19.82 49.93,18.64 49.93,8.1 49,7.17 MOT_RIGHT.3
ENC3_A
  Bottom 0.254: U$1.38/A19 R6.1 31.78,18.8 29.98,18.8 28.08,16.9 MOT_FRONT.4
ENC3_B
  Bottom 0.254: U$1.37/A18 30.97,20.55 R5.1 26.67,16.19 MOT_FRONT.3
GND  (via drill 0.35)
  other vias: 57.25,31.75 28.12,31.5 74.62,34.88 58.88,7.62 37.88,14.5 39.12,14.5 40.38,14.5 37.88,7.62 39.12,7.62 40.38,7.62 60.12,7.62 61.38,7.62 58.88,14.5 60.12,14.5 61.38,14.5 37.88,6.62 39.12,6.62 40.38,6.62 40.38,5.62 39.12,5.62 37.88,5.62 58.88,6.62 58.88,5.62 60.12,5.62 60.12,6.62 61.38,6.62 61.38,5.62 37.88,12.38 39.12,12.38 40.38,12.38 58.88,12.38 60.12,12.38 61.38,12.38 11.5,45.12 13.12,53 11.5,51.5 11.5,53 11.5,50 13.12,42.12 11.5,43.62 11.5,42.12 55.88,76.25 55.88,75.12 55.88,74 49.5,69 48.5,69 47.5,69 47,68.12 50.75,62.75 50.75,61.75 51.75,62.75 51.75,61.75 43.62,60.5 46.88,60.5 60.62,64 49.75,62.75 48.75,62.75 48.75,61.75 49.75,61.75 52.75,61.75 52.75,62.75 53.75,62.75 53.75,61.75
  pour Top: 100,70.5 70.5,100 29.5,100 0,70.5 0,29.5 29.5,0 70.5,0 100,29.5 100,50.5 83.38,50.5 83.38,52.38 83.5,58.75 86.25,61.5 100,61.5
  pour Bottom: 100,70.5 70.5,100 29.5,100 0,70.5 0,29.5 29.5,0 70.5,0 100,29.5 100,50.5 83.38,50.5 83.5,58.75 86.25,61.5 100,61.5
I2C_SCL  (via drill 0.35)
  Top 0.254: SENSOR6.3 90.47,76.57 90.82,76.92 90.82,78.56 89.38,80 87.38,80 83.91,76.53 79.59,76.53 76.53,79.59 76.53,83.91 79.59,86.97 | 77.26,62.57 77.26,62.49 74.12,59.36 74.12,52.87 78.03,48.96 78.03,44.35 77.65,43.97 69.57,43.97 65.38,39.78 v65.38,38.12 | v61.5,38.12 61.5,24.3 U$1.19/A5 | 77.26,62.57 | 50.51,85.62 49.49,85.62 48.28,84.4 EXT2.8 | EXT2.4 51.72,84.4 50.51,85.62 | SENSOR6.3 | SENSOR3.3 SENSOR1.3 8.47,75.51 8.12,75.86 8.12,77.55 10.7,80.12 12.5,80.12 13.03,79.59 | SENSOR6.3 SENSOR4.3 77.26,62.57 | 50.51,85.62 52.5,87.61 52.5,96.62 | 13.03,79.59 16.09,76.53 20.41,76.53 23.46,79.59 23.46,83.91 19.75,87.63 19.75,89.12 22.75,92.12 | 13.03,79.59 | 22.75,92.12 27.25,96.62 52.5,96.62 | SENSOR2.3 22.75,91.94 22.75,92.12 | 52.5,96.62 72.75,96.62 76.31,93.06 | 76.31,93.06 79.88,89.5 79.88,87.25 79.59,86.97 | 79.59,86.97 | SENSOR5.3 76.25,93.06 76.31,93.06
  Bottom 0.254: v65.38,38.12 v61.5,38.12
I2C_SDA
  Top 0.254: 74.53,57.72 74.53,53.04 78.44,49.13 78.44,44.18 77.82,43.56 72.62,43.56 72.44,43.56 71.19,43.56 67.55,39.92 67.55,39.07 65.94,37.47 64.05,37.47 62.47,39.05 62.47,39.92 61.87,40.51 61.03,40.51 60.43,39.92 60.43,37.11 58.91,35.59 U$1.18/A4 | 74.53,57.72 | 74.53,57.72 SENSOR4.4 SENSOR6.4 | 74.53,57.72 | SENSOR1.4 SENSOR3.4
  Bottom 0.254: SENSOR1.4 9.53,76.57 9.18,76.92 9.18,78.61 10.7,80.12 12.51,80.12 16.09,76.54 20.41,76.54 23.46,79.59 23.46,83.91 19.75,87.61 19.75,89.12 23.69,93.06 | SENSOR6.4 91.53,75.51 91.88,75.86 91.88,77.55 89.43,80 87.36,80 83.91,76.54 79.59,76.54 76.54,79.59 76.54,83.91 79.88,87.24 79.88,89.5 77.31,92.06 | 52.5,96.62 27.25,96.62 23.69,93.06 | 52.5,96.62 72.75,96.62 77.31,92.06 | 52.5,85.62 52.03,85.62 50.82,84.4 EXT2.6 | 52.5,85.62 53.05,85.62 54.26,84.4 EXT2.2 | 52.5,85.62 52.5,96.62 | SENSOR6.4 | SENSOR2.4 25.22,91.53 23.69,93.06 | SENSOR5.4 77.31,92 77.31,92.06
LED_BTN_PROG
  Top 0.254: U$1.17/A3 55.27,24.25 54.25,23.24 45.79,23.24 45.19,23.83 45.19,24.7 37.17,32.72 37.17,40.08 40.12,43.04 R21.1
LED_BUILTIN
  Bottom 0.254: R26.1 U$1.5
MOT1_1
  Top 0.254: U1.2 64.57,22.2 65.12,22.75 67.56,22.75 U$1.22/A8
MOT1_2  (via drill 0.35)
  Top 0.254: U1.9 55.68,16.82 v55.75,16.75
  Bottom 0.254: v55.75,16.75 65.36,16.75 71.61,23 U$1.23/A9
MOT1_OUT1
  Top 0.61: U1.3 63.3,17.45 64.62,16.12 66.5,16.12 69.09,13.54 MOT_LEFT.1
MOT1_OUT2  (via drill 0.35)
  Top 0.61: v57,15.88 56.95,15.92 U1.8
  Bottom 0.61: MOT_LEFT.6 73.7,15.88 v57,15.88
MOT2_1
  Top 0.254: U1.19 64.57,15.35 62.72,17.21 62.72,21.94 63.94,23.16 67.25,23.16 67.75,23.66 67.75,33.2 U$1.6
MOT2_2  (via drill 0.35)
  Top 0.254: U1.12 55.68,11.68 57.62,13.62 57.62,15.57 57.66,15.6 57.66,16.15 57.62,16.18 v57.62,26.12
  Bottom 0.254: v57.62,26.12 62.11,26.12 U$1.20/A6
MOT2_OUT1  (via drill 0.35)
  Top 0.61: MOT_RIGHT.1 52.75,13.5 v56.38,13.5 | v63.25,13.5 63.3,13.45 U1.18
  Bottom 0.61: v56.38,13.5 v63.25,13.5
MOT2_OUT2
  Top 0.61: U1.13 56.95,7.7 MOT_RIGHT.6
MOT3_1  (via drill 0.35)
  Top 0.254: U2.19 43.57,15.82 v43.62,15.88 | v35.07,15.88 v25.88,15.88
  Bottom 0.254: v43.62,15.88 v35.07,15.88 | v25.88,15.88 25.88,24.24 U$1.35/A16
MOT3_2
  Top 0.254: 34.68,9.75 U2.12 34.68,12.88 36.53,14.73 36.53,17.14 36.53,17.15 36.15,17.53 33.99,17.53 33.99,21.26 33,22.25 29.5,22.25 28.43,23.32 U$1.36/A17
MOT3_OUT1  (via drill 0.35)
  Top 0.61: MOT_FRONT.1 34.21,13.41 v34.25,13.38 | v42.25,13.38 42.3,13.33 U2.18
  Bottom 0.61: v34.25,13.38 v42.25,13.38
MOT3_OUT2
  Top 0.61: U2.13 35.95,8.58 35.38,8 32.57,8 MOT_FRONT.6
N$1
  Bottom 0.254: T2.3 42.5,27.73 R12.2
N$2
  Bottom 0.254: D2.A 41.25,59.38 38.88,61.75 R20.1
N$3
  Top 0.254: R22.1 74.06,48.9 73.2,49.76 71.74,49.76 U$6.B2
N$4
  Bottom 0.254: R8.2 52.38,32.62 51.2,31.44 51.2,29.61 52.38,28.43 52.38,28 | 52.38,28 R9.1 | T1.1 54.98,28 52.38,28
N$5
  Bottom 0.254: R8.1 53.77,34.62 Q1.3
N$6
  Bottom 0.254: T3.3 29.75,27.73 R16.2
N$7
  Bottom 0.254: T2.1 36.58,28.18 R11.1 36.12,28.43 34.95,29.61 34.95,31.44 36.12,32.62 R10.2
N$8
  Bottom 0.406: R39.1 55.64,65.24 BK.7
N$9
  Bottom 0.254: 85.65,43.87 85.49,44.03 85.1,44.03 U3.31 | U3.24 85.1,34.97 85.49,34.97 85.65,35.13 85.65,43.87 | 85.65,43.87 85.65,49.87 85.49,50.03 83.26,50.03 78.51,45.28 77.1,45.28 76.65,44.83 R7.1
N$10
  Bottom 0.254: D1.A 41.61,47.62 64.5,47.62 69.75,42.38 R7.2
N$11
  Bottom 0.254: Q2.3 37.52,34.62 R10.1
N$12
  Bottom 0.254: R26.2 61.24,44.77 D3.A
N$13
  Bottom 0.254: T3.1 23.82,28.18 R15.1 23.38,28.43 22.2,29.61 22.2,31.44 23.38,32.62 R14.2
N$14
  Bottom 0.254: R14.1 24.77,34.62 Q3.3
N$15
  Top 0.61: PWR.1 2.3,35.92 J7.VIN0 5.38,47.58 5.38,51.5 14.75,60.88 ON/OFF.1
N$16
  Top 0.254: S2.A 41.65,50 R21.2
N$17
  Bottom 0.254: SENSOR6.2 89.59,76.66 89.59,75.41 91.16,73.84 92.41,73.84 SENSOR6.5
N$18
  Bottom 0.254: 83.1,38.13 83.26,37.97 83.65,37.97 U3.26 | U3.34 83.65,48.53 83.26,48.53 83.1,48.37 83.1,38.13 | S1.2 87.56,24 | 87.56,24 86,24 83.1,26.9 83.1,38.13 | S1.3 90.82,24.95 R19.1 87.56,25.79 87.56,24
N$19
  Bottom 0.254: R23.2 58.75,27.73 T1.3
N$20
  Bottom 0.254: R36.1 87.63,75.07 | 87.63,75.07 SENSOR4.2 | R25.2 94.81,69.49 93.43,70.87 90.59,70.87 88.13,73.32 88.13,74.57 87.63,75.07
N$21
  Bottom 0.254: SENSOR4.5 93.11,69.66 R28.1
N$22
  Bottom 0.254: R32.2 72.76,89.09 R31.2 72.74,91.67 SENSOR5.2
N$23
  Bottom 0.254: R32.1 76.84,89.22 SENSOR5.5
N$24
  Bottom 0.254: SENSOR2.2 25.26,87.31 R29.2 R30.2
N$25
  Bottom 0.254: SENSOR2.5 29.24,89.69 R30.1
N$26
  Bottom 0.254: R33.2 4.51,71.36 R35.2
N$27
  Bottom 0.254: R35.1 9.18,71.95 | 9.18,71.95 10.38,73.16 R34.2 | SENSOR3.2 9.18,71.89 9.18,71.95
N$28
  Bottom 0.254: SENSOR3.5 14.41,72.66 14.41,71.41 10.51,67.51 R33.1
N$29
  Bottom 0.254: R36.2 90.92,73.51 92.71,71.72 95.02,71.72 R28.2
N$30
  Bottom 0.406: BK.5 54.25,68.31 R38.1 R37.2
N$32
  Bottom 0.406: BK.8 53.76,64 C3.1
N$33
  Bottom 0.406: C7.1 54.78,66.51 BK.6
N$34
  Bottom 0.61: BK.3 46.84,66.51 C6.2 44.84,68.52 44.84,69.1 44.18,69.75 42.75,69.75 42.75,73.1 L1.2
N$35
  Bottom 0.406: R27.1 56.52,69.95 C7.2
N$36  (via drill 0.35)
  Top 0.406: v44,68.75 44,64.5 44.25,64.25 v47,64.25
  Bottom 0.406: C6.1 44.02,68.72 v44,68.75 | BK.1 47.28,63.97 v47,64.25
RST
  Bottom 0.254: U$1.RST_3.5 32.16,26.8 32.02,26.65 19.5,26.65 19.34,26.65 18.09,26.65 3.74,41 3.74,57.62 RST.1
RX4
  Top 0.254: EXT1.2 29.98,75.34 31.38,73.94 31.38,72.93 28.59,70.14 28.59,44.73 U$1.31/A12
RX5
  Top 0.254: U$1.34/A15 23.35,35.52 19.79,39.07 19.79,39.92 23.35,43.47 23.35,68.47 26.38,71.5 26.38,73.6 EXT1.6
S1  (via drill 0.35)
  Top 0.254: v55.12,36.38 v55.12,32.88 | v18.38,69 38.38,89 49.62,89 51.21,90.59 BATT.2
  Bottom 0.254: T1.2 55.12,30.07 | 55.12,30.07 52.83,30.07 R9.2 | v55.12,36.38 53.02,38.48 45.4,38.48 44.69,39.19 44.69,39.92 44.09,40.51 43.25,40.51 42.65,39.92 42.65,39.07 41.99,38.41 17.71,38.41 16.88,39.25 16.88,59.18 16.37,59.68 16.37,67 v18.38,69 | v55.12,32.88 55.12,30.07
S2  (via drill 0.35)
  Top 0.254: v38.62,37.38 38.62,33.25 v39.38,32.5 | v17.25,70 36.88,89.62 47.5,89.62 48.67,90.8 BATT.3
  Bottom 0.254: R11.2 36.58,30.07 T2.2 39.38,30.55 v39.38,32.5 | v38.62,37.38 37.45,37.38 36.81,38.01 17.54,38.01 16.38,39.17 16.38,59.11 15.97,59.51 15.97,68.72 v17.25,70
S3  (via drill 0.35)
  Top 0.254: v16.38,70.88 37.5,92 BATT.4
  Bottom 0.254: T3.2 23.82,30.07 R15.2 23.38,31.13 24.55,32.31 24.55,34.14 24.39,34.3 19.37,34.3 15.97,37.71 15.97,57.55 13.83,59.68 13.83,68.33 v16.38,70.88
SPI_CS1
  Top 0.254: U$1.15/A1 51.29,35.52 54.85,39.07 54.85,40.65 76.86,62.66 76.86,69.67 EXT3.2
SPI_CS2
  Top 0.254: EXT3.4 75.41,69.59 76.45,68.55 76.45,62.83 74.12,60.5 53.83,40.21 U$1.9
SPI_CS3
  Top 0.254: EXT3.6 73.61,71.39 74.65,70.35 74.65,69.34 73.84,68.52 73.84,60.8 53.56,40.51 53.41,40.51 52.39,39.49 U$1.10
SPI_MISO
  Top 0.254: EXT3.5 71.64,63.31 57.21,48.88 55.71,48.88 51.29,44.46 51.14,44.31 46.32,39.49 U$1.12
SPI_MOSI
  Top 0.254: EXT3.3 73.43,62.76 53.06,42.39 51.65,42.39 U$1.11
SPI_SCK
  Top 0.254: EXT3.8 71.47,75.76 71.47,77.48 70.53,78.42 69.52,78.42 68.8,77.71 68.8,76.7 69.61,75.89 69.61,74.93 68.62,73.94 68.62,70.13 39,40.51 38.17,40.51 37.57,39.92 37.57,39.07 37.62,39.02 37.62,32.84 U$1.13
TX4
  Top 0.254: EXT1.4 28.18,73.18 27.14,72.14 27.14,71.13 28.18,70.09 28.18,46.87 U$1.32/A13
TX5
  Top 0.254: U$1.33/A14 20.2,24.86 12.01,24.86 0.82,36.05 0.82,46.02 4.79,49.99 4.79,51.74 13.83,60.78 13.83,62.78 22.29,71.24 24.01,71.24 EXT1.8
WIFI_RX
  Top 0.254: U$1.7 58.91,42.49 U$6.A2
WIFI_TX
  Top 0.254: U$1.8 57.47,39.49 58.49,38.48 59.33,38.48 59.93,39.07 59.93,41.8 62.5,44.37 70.95,44.37 U$6.D1

### Text on the board
tPlace: 2 | MR-ROBOTICS.COM | 5 | I2C | 1 | 6 | UART | SPI | 3 | 4 | RST | ON/OFF | WIFI | BUZZER | GND | X | Cut the VUSB / trace on Teensy / before soldering / / Compatible only / with Teensy 3.2 / & Teensy 3.5 | Y | VCC | OFF | AT-MODE | ON | Motor Front | Motor Left | Motor Right
bPlace: BATT | I2C | UART | SPI | BLUETOOTH | CO-FOUNDERS / Olivier L / Mathieu S / Guillaume S | ROBOTICS | MR. | BOARD MODEL | Designed / in Paris | Brainzy v3.2